# Altium project M1.5_A2L1.PrjPcb
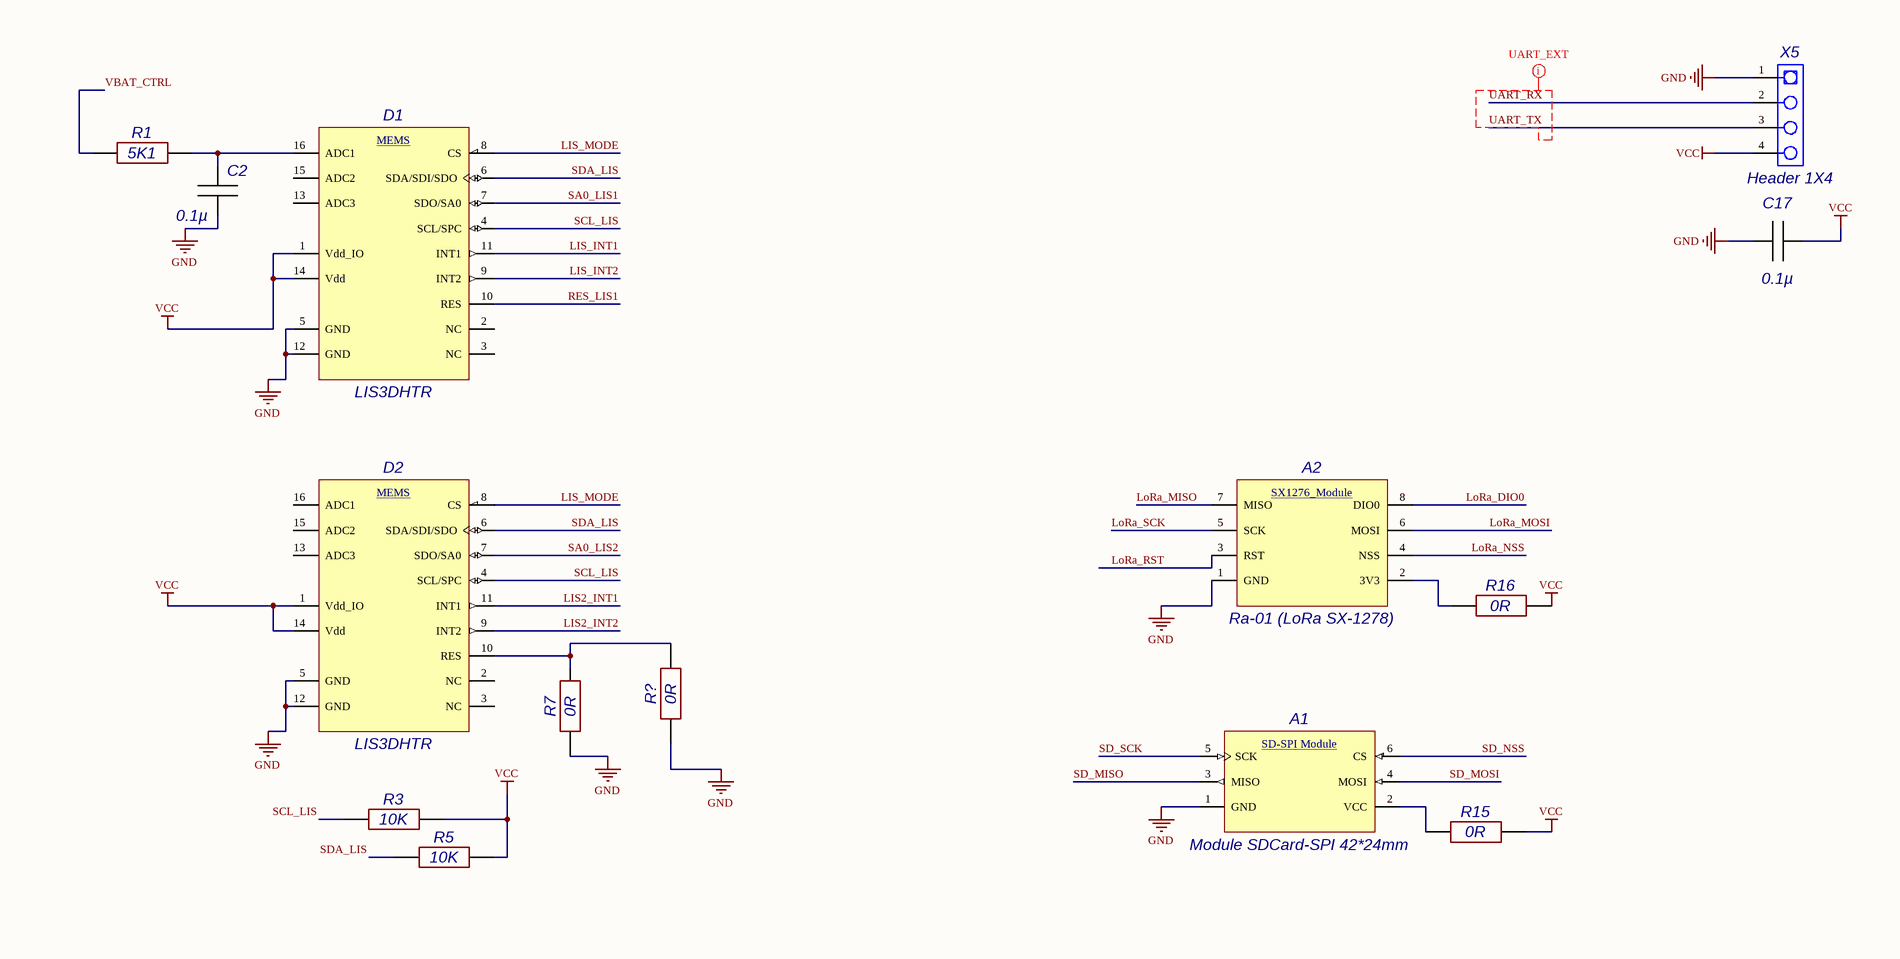
[diagram p0: M1.5_A2L1.SchDoc, top]
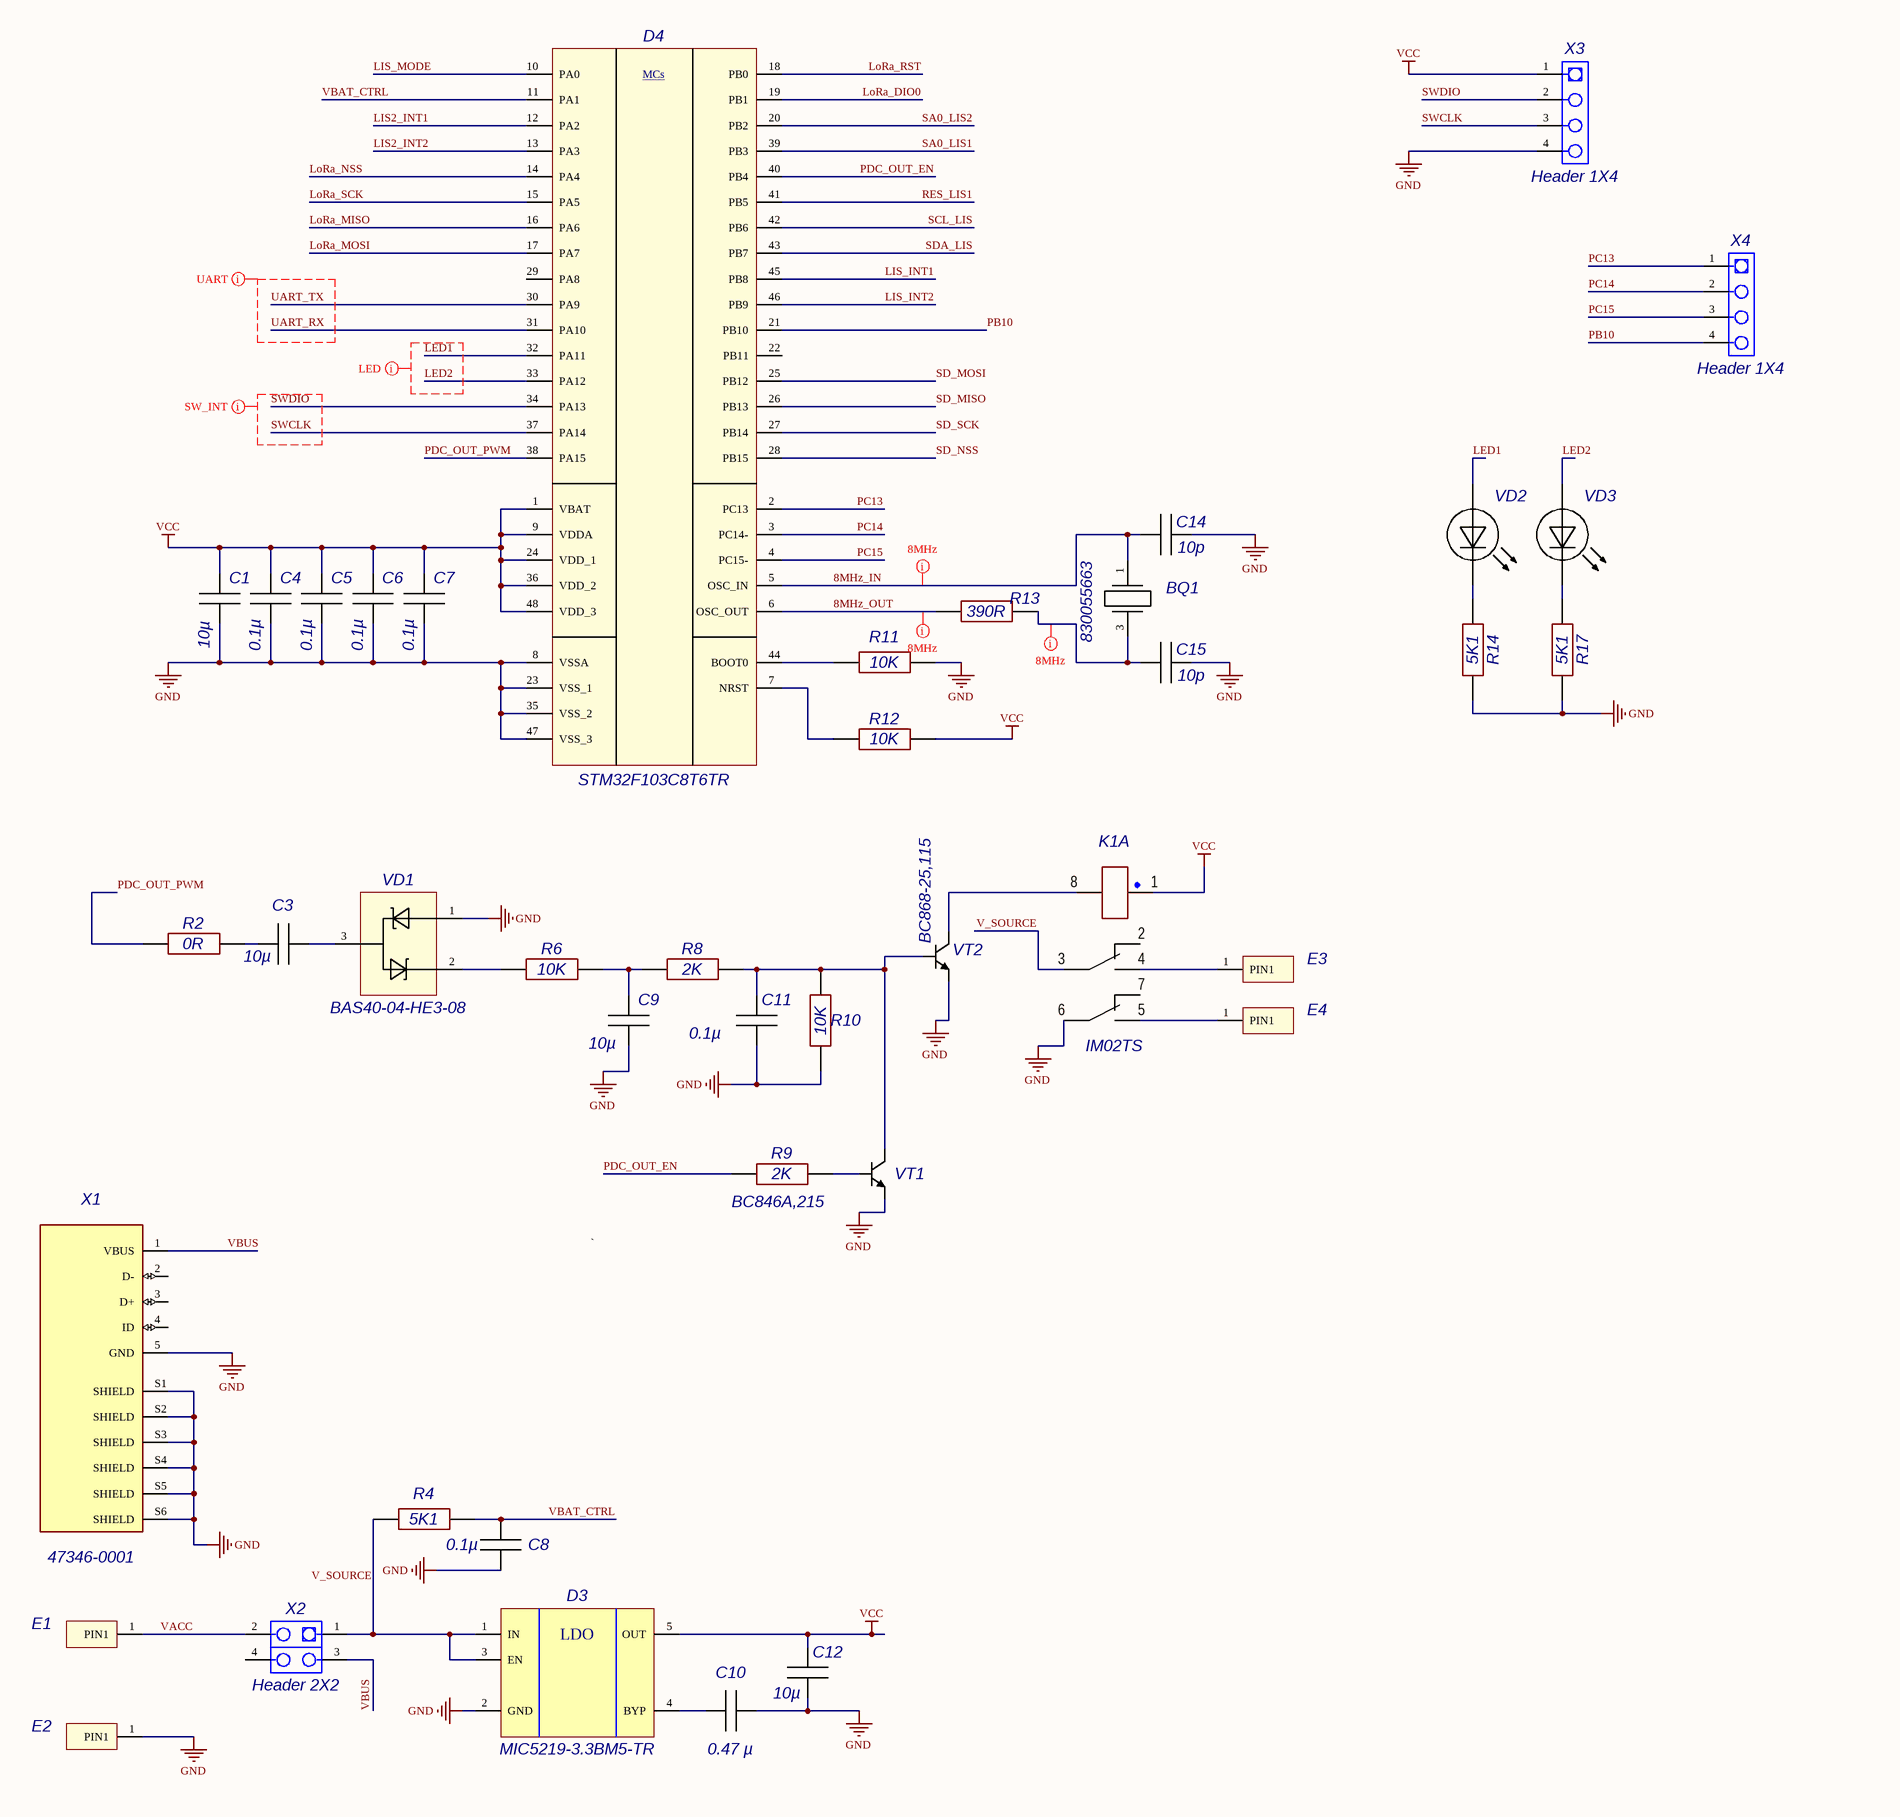
[diagram p1: M1.5_A2L1.SchDoc, bottom]
1 sheet, 55 parts. Net scope: global (net labels, ports and power ports of the same name join across sheets).
Board file: M1.7_A2L1_32mm.PcbDoc

## Sheet M1.5_A2L1.SchDoc
size A2 portrait; SheetNumber: 1; SheetTotal: 1

### Parts
A1  Module SDCard-SPI 42*24mm  [Module SD2SPI]
A2  Ra-01 (LoRa SX-1278)  [Module SX1278]
BQ1  830055663  [Quartz5032]
C1  10µ  [Cap0805]
C2  0.1µ  [Cap0603]
C3  10µ  [Cap0805]
C4  0.1µ  [Cap0603]
C5  0.1µ  [Cap0603]
C6  0.1µ  [Cap0603]
C7  0.1µ  [Cap0603]
C8  0.1µ  [Cap0603]
C9  10µ  [Cap0805]
C10  0.47 µ  [Cap0603]
C11  0.1µ  [Cap0603]
C12  10µ  [Cap0805]
C14  10p  [Cap0603]
C15  10p  [Cap0603]
C17  0.1µ  [Cap0603]
D1  LIS3DHTR  [LGA-16]
D2  LIS3DHTR  [LGA-16]
D3  MIC5219-3.3BM5-TR  [SOT23-5]
D4  STM32F103C8T6TR  [LQFP-48]
E1  Lamel_1pin  [Lamel_1pin(1.5*3)]  (value not drawn)
E2  Lamel_1pin  [Lamel_1pin(1.5*3)]  (value not drawn)
E3  Lamel_1pin  [Lamel_1pin(1.5*3)]  (value not drawn)
E4  Lamel_1pin  [Lamel_1pin(1.5*3)]  (value not drawn)
K1  IM02TS  [IM02TS]  (parts A,B,C of 3)
R1  5K1  [RES0603]
R2  0R  [RES0603]
R3  10K  [RES0603]
R4  5K1  [RES0603]
R5  10K  [RES0603]
R6  10K  [RES0603]
R7  0R  [RES0603]
R8  2K  [RES0603]
R9  2K  [RES0603]
R10  10K  [RES0603]
R11  10K  [RES0603]
R12  10K  [RES0603]
R13  390R  [RES0603]
R14  5K1  [RES0603]
R15  0R  [RES0603]
R16  0R  [RES0603]
R17  5K1  [RES0603]
R?  0R  [RES0603]
VD1  BAS40-04-HE3-08  [SOT23]
VD2  19-213/GHC-YR1S2/3T  [LED0603]  (value not drawn)
VD3  19-213/GHC-YR1S2/3T  [LED0603]  (value not drawn)
VT1  BC846A,215  [SOT23]
VT2  BC868-25,115  [SOT89]
X1  47346-0001  [MOLEX_47346-0001]
X2  Header 2X2  [PLS2-2]
X3  Header 1X4  [PLS1-4]
X4  Header 1X4  [PLS1-4]
X5  Header 1X4  [PLS1-4]

### Nets
GND: A1.1(GND) A2.1(GND) C1.2 C2.2 C4.2 C5.2 C6.2 C7.2 C8.2 C9.2 C10.2 C11.2 C12.2 C14.2 C15.2 C17.2 D1.5(GND) D1.12(GND) D2.5(GND) D2.12(GND) D3.2(GND) D4.8(VSSA) D4.23(VSS_1) D4.35(VSS_2) D4.47(VSS_3) E2.1(PIN1) K1.6 R7.1 R10.1 R11.2 R14.2 R17.2 R?.1 VD1.1 VT1.2(E) VT2.1(E) X1.5(GND) X1.S1(SHIELD) X1.S2(SHIELD) X1.S3(SHIELD) X1.S4(SHIELD) X1.S5(SHIELD) X1.S6(SHIELD) X3.4 X5.1
VCC: C1.1 C4.1 C5.1 C6.1 C7.1 C12.1 C17.1 D1.1(Vdd_IO) D1.14(Vdd) D2.1(Vdd_IO) D2.14(Vdd) D3.5(OUT) D4.1(VBAT) D4.9(VDDA) D4.24(VDD_1) D4.36(VDD_2) D4.48(VDD_3) K1.1 R3.2 R5.2 R12.2 R15.2 R16.2 X3.1 X5.4
8MHz_IN: BQ1.1(Crystal) C14.1 D4.5(OSC_IN)
8MHz_OUT: D4.6(OSC_OUT) R13.1
LED1: D4.32(PA11) VD2.1
LED2: D4.33(PA12) VD3.1
LIS2_INT1: D2.11(INT1) D4.12(PA2)
LIS2_INT2: D2.9(INT2) D4.13(PA3)
LIS_INT1: D1.11(INT1) D4.45(PB8)
LIS_INT2: D1.9(INT2) D4.46(PB9)
LIS_MODE: D1.8(CS) D2.8(CS) D4.10(PA0)
LoRa_DIO0: A2.8(DIO0) D4.19(PB1)
LoRa_MISO: A2.7(MISO) D4.16(PA6)
LoRa_MOSI: A2.6(MOSI) D4.17(PA7)
LoRa_NSS: A2.4(NSS) D4.14(PA4)
LoRa_RST: A2.3(RST) D4.18(PB0)
LoRa_SCK: A2.5(SCK) D4.15(PA5)
PB10: D4.21(PB10) X4.4
PC13: D4.2(PC13) X4.1
PC14: D4.3(PC14-) X4.2
PC15: D4.4(PC15-) X4.3
PDC_OUT_EN: D4.40(PB4) R9.1
PDC_OUT_PWM: D4.38(PA15) R2.1
RES_LIS1: D1.10(RES) D4.41(PB5)
SA0_LIS1: D1.7(SDO/SA0) D4.39(PB3)
SA0_LIS2: D2.7(SDO/SA0) D4.20(PB2)
SCL_LIS: D1.4(SCL/SPC) D2.4(SCL/SPC) D4.42(PB6) R3.1
SD_MISO: A1.3(MISO) D4.26(PB13)
SD_MOSI: A1.4(MOSI) D4.25(PB12)
SD_NSS: A1.6(CS) D4.28(PB15)
SD_SCK: A1.5(SCK) D4.27(PB14)
SDA_LIS: D1.6(SDA/SDI/SDO) D2.6(SDA/SDI/SDO) D4.43(PB7) R5.1
SWCLK: D4.37(PA14) X3.3
SWDIO: D4.34(PA13) X3.2
UART_RX: D4.31(PA10) X5.2
UART_TX: D4.30(PA9) X5.3
V_SOURCE: D3.1(IN) D3.3(EN) K1.3 R4.1 X2.1
VACC: E1.1(PIN1) X2.2
VBAT_CTRL: C8.1 D4.11(PA1) R1.1 R4.2
VBUS: X1.1(VBUS) X2.3
NetA1_2: A1.2(VCC) R15.1
NetA2_2: A2.2(3V3) R16.1
NetBQ1_3: BQ1.3(Crystal) C15.1 R13.2
NetC2_1: C2.1 D1.16(ADC1) R1.2
NetC3_1: C3.1 VD1.3
NetC3_2: C3.2 R2.2
NetC9_1: C9.1 R6.2 R8.1
NetC10_1: C10.1 D3.4(BYP)
NetC11_1: C11.1 R8.2 R10.2 VT1.3(C) VT2.3(B)
NetD2_10: D2.10(RES) R7.2 R?.2
NetD4_7: D4.7(NRST) R12.1
NetD4_44: D4.44(BOOT0) R11.1
NetE3_1: E3.1(PIN1) K1.4
NetE4_1: E4.1(PIN1) K1.5
NetK1_8: K1.8 VT2.2(C)
NetR6_1: R6.1 VD1.2
NetR9_2: R9.2 VT1.1(B)
NetR14_1: R14.1 VD2.2
NetR17_1: R17.1 VD3.2

Not connected (* = marked no-connect by the designer): D1 2(NC) 3(NC) 13(ADC3) 15(ADC2); D2 2(NC) 3(NC) 13(ADC3) 15(ADC2) 16(ADC1); D4 22(PB11) 29(PA8); K1 2 7; X1 2(D-) 3(D+) 4(ID); X2 4

### Layout directives
net class 8MHz: 8MHz_IN, 8MHz_OUT, NetBQ1_3
net class SW_INT: SWCLK, SWDIO
net class LED: LED1, LED2, UART_RX, UART_TX
net class UART_EXT: UART_RX, UART_TX

### Notes on the sheet
- `
- (in symbol LIS3DHTR) MEMS
- (in symbol MIC5219-3.3BM5-TR) LDO
- (in symbol Module SDCard-SPI) SD-SPI Module
- (in symbol Module SX1278) SX1276_Module
- (in symbol STM32F103C8T6) MCs

### Library data of the parts
A1 = Module SDCard-SPI: MicroSD Card adapter (42*24mm)/Arduino; Supply voltage: 5±0.5V; Current consumption typ(max): 80mA (200mA); Connections: 6pin IDC1-6; Support format: Micro SDCard(<=2G), Micro SDHC(<=32G); Manufacture Part Number: Module SDCard-SPI 42*24mm; ComponentLink1Description: Link; ComponentLink1URL: http://datalogger.pbworks.com/w/file/fetch/89507207/Datalogger%20-%20SD%20Memory%20Reader%20Datasheet.pdf; Dimensions: 42*24*12mm; Weight: 5g
A2 = Module SX1278: SX1278 LoRa  433 MHZ/SPI /Spring Antenna/Ra - 01; ComponentLink1Description: Link; ComponentLink1URL: http://www.ai-thinker.com/pro_view-5.html; Manufacture Part Number: Ra-01 (LoRa SX-1278)
BQ1 = 830055663: WE-XTAL QUARTZ CRYSTAL 8.0 MHZ; Manufacture: Würth Elektronik; Catagory: Crystals, Oscillators, Resonators, Crystals; Frequency: 8 MHz; Frequency Stability: ±30ppm; Frequency Tolerance: ±20ppm; Load Capacitance: 18pF; ESR (Equivalent Series Resistance): 150 Ohms; Operating Mode: Fundamental; Digi-Key Part Number: 1923-830055663TR-ND; Package/Case: 4-SMD, No Lead; Type: MHz Crystal; Price ($): $0.65; ComponentLink1Description: HelpURL; ComponentLink1URL: https://www.digikey.com/en/products/detail/w%C3%BCrth-elektronik/830055663/13900244?s=N4IgTCBcDaIBwGYAMSCsqBsGEgLoF8g; Manufacture Part Number: 830055663; Series: CFPX-104
C1 C3 C9 C12 = CC0805KKX7R6BB106: CAP CER 10UF 10V X7R 0805; Manufacture: YAGEO; Catagory: Capacitors, Ceramic Capacitors; Tolerance: ±10%; Digi-Key Part Number: 311-1879-2-ND; Manufacture Part Number: CC0805KKX7R6BB106; Package/Case: 0805 (2012 Metric); Price($/10): $1.62; ComponentLink2Description: Link; ComponentLink2URL: https://www.digikey.com/en/products/detail/yageo/CC0805KKX7R6BB106/5195285; Capacitance: 10µ; Temperature Coefficient: X7R
C2 C4-C8 C11 C17 = CC0603KRX7R9BB104: CAP CER 0.1UF 50V X7R 0603; Manufacture: YAGEO; Catagory: Capacitors, Ceramic Capacitors; Tolerance: ±10%; Digi-Key Part Number: 311-1344-2-ND; Manufacture Part Number: CC0603KRX7R9BB104; Package/Case: 0603 (1608 Metric); Price($/10): $0.54; ComponentLink2Description: Link; ComponentLink2URL: https://www.digikey.com/en/products/detail/yageo/CC0603KRX7R9BB104/2103082?s=N4IgTCBcDaIMJwAwDZEGYDSAlAGgdiwE4AhYgRkQBYQBdAXyA; Capacitance: 0.1µ; Temperature Coefficient: X7R
C10 = CC0603KRX7R6BB474: CAP CER 0.47UF 10V X7R 0603; Manufacture: YAGEO; Catagory: Capacitors, Ceramic Capacitors; Tolerance: ±10%; Digi-Key Part Number: 311-1798-2-ND; Manufacture Part Number: CC0603KRX7R6BB474; Package/Case: 0603 (1608 Metric); Price($/10): $1.22; ComponentLink2Description: Link; ComponentLink2URL: https://www.yageo.com/upload/media/product/productsearch/datasheet/mlcc/UPY-GPHC_X7R_6.3V-to-50V_20.pdf; Capacitance: 0.47 µ; Temperature Coefficient: X7R; ComponentLink3Description: Link supplier; ComponentLink3URL: https://www.digikey.com/en/products/detail/yageo/CC0603KRX7R6BB474/5195206?s=N4IgTCBcDaIMJwAwDZEGYDSAlAGgdi2QCEiAWPUkAXQF8g
C14 C15 = CQ0603JRNPO9BN100: CAP CER 10PF 50V C0G/NPO 0603; Manufacture: YAGEO; Catagory: Capacitors, Ceramic Capacitors; Temperature Coefficient: COG, NPO; Tolerance: ±5%; Digi-Key Part Number: CQ0603JRNPO9BN100-ND; Manufacture Part Number: CQ0603JRNPO9BN100; Package/Case: 0603 (1608 Metric); Price($/20k): $970,8; ComponentLink2Description: Link; ComponentLink2URL: https://www.digikey.com/en/products/detail/yageo/cq0603jrnpo9bn100/6097785; Capacitance: 10p
D1 D2 = LIS3DHTR: ACCEL 2-16G I2C/SPI 16LGA; Manufacture: STMicroelectronics; Catagory: Sensors, Transducers, Motion Sensors - Accelerometers; Digi-Key Part Number: 497-10613-2-ND - Tape & Reel; Manufacture Part Number: LIS3DHTR; Package/Case: 16-LGA (3x3); Price($): $2.11000; Value: LIS3DHTR; ComponentLink2Description: Link; ComponentLink2URL: https://www.st.com/en/mems-and-sensors/lis3dh.html; ComponentLink3Description: Link Supplier; ComponentLink3URL: https://www.digikey.com/en/products/detail/stmicroelectronics/LIS3DHTR/2334338?s=N4IgTCBcDaIDIEkDKBmAIgCQCoCUQF0BfIA
D3 = MIC5219-3.3BM5-TR: IC REG LINEAR 3.3V 500MA SOT23-5; Manufacture: Microchip Technology; Catagory: Integrated Circuits (ICs), Power Management (PMIC), Voltage Regulators - Linear; Voltage - Input (Max): 12V; Voltage Dropout (Max): 0.6V @ 500mA; Current - Quiescent (Iq): 8 µA; PSRR: 75dB (120Hz); Control Features: Enable; Digi-Key Part Number: MIC5219-3.3BM5-TR; Manufacture Part Number: MIC5219-3.3BM5-TR; Package/Case: SOT-23-5; ComponentLink2Description: Link; ComponentLink2URL: https://ww1.microchip.com/downloads/en/DeviceDoc/MIC5219-500mA-Peak-Output-LDO-Regulator-DS20006021A.pdf; Voltage - Output (Min/Fixed): 3.3V; Current - Output: 500mA; ComponentLink3Description: Link Supplier; ComponentLink3URL: https://www.digikey.com/en/products/detail/microchip-technology/MIC5219-3-3BM5-TR/771289?s=N4IgTCBcDaILIEkDCBWMBGAnAWgMwDpcAhOFEAXQF8g
D4 = STM32F103C8T6: ARM® Cortex®-M3 STM32F1 Microcontroller IC 32-Bit Single-Core 72MHz 64KB (64K x 8) FLASH 48-LQFP (7x7); Manufacture: STMicroelectronics; Catagory: Integrated Circuits (ICs), Embedded Microcontrollers; sym_version: 1; Digi-Key Part Number: 497-17666-2-ND; Manufacture Part Number: STM32F103C8T6TR; Package/Case: 48-LQFP; Price($): $7.64; Value: STM32F103C8T6TR; ComponentLink2Description: Link; ComponentLink2URL: https://www.digikey.com/en/products/detail/stmicroelectronics/STM32F103C8T6TR/2122442
K1 = IM02TS: RELAY TELECOM DPDT 2A 4.5VDC; Manufacture: TE Connectivity Potter & Brumfield Relays; Catagory: Relays, Signal Relays, Up to 2 Amps; Contact Form: DPDT (2 Form C); Switching Voltage: 250VAC, 220VDC - Max; Digi-Key Part Number: PB1093-ND; Manufacture Part Number: IM02TS; Series: IM, AXICOM; Price($): $4.59; ComponentLink2Description: Link Supplier; ComponentLink2URL: https://www.digikey.com/en/products/detail/te-connectivity-potter-brumfield-relays/IM02TS/1633979?s=N4IgTCBcDaIJIFkAMYAqBlEBdAvkA; Mounting Type: Through Hole; Coil Voltage: 4.5VDC; Contact Rating (Current): 2 A; ComponentLink3Description: Link; ComponentLink3URL: https://www.te.com/commerce/DocumentDelivery/DDEController?Action=srchrtrv&DocNm=1-1773734-7_IM_Relay_I_Type&DocType=DS&DocLang=English
R1 R4 R14 R17 = RC0603FR-075K1L: RES 5K1 OHM 1% 1/10W 0603; Manufacture: Yageo; Catagory: Resistors; Power(Watts): 0.1W, 1/10W; Digi-Key Part Number: 311-5.10KHRTR-ND; Package/Case: 0603 (1608 Metric); Tolerance: ±1%; Resistance: 5K1; Price 1k($): $3.90; ComponentLink1Description: HelpURL; ComponentLink1URL: https://www.digikey.com/en/products/detail/yageo/RC0603FR-075K1L/727268?s=N4IgTCBcDaIEoGEAMA2JBmAYnAtEg7AKwDSAjADIgC6AvkA; Manufacture Part Number: RC0603FR-075K1L
R2 R7 R15 R16 R? = RC0603FR-070RL: RES 0 OHM JUMPER 1/10W 0603; Manufacture: Yageo; Catagory: Resistors; Power(Watts): 0.1W, 1/10W; Tolerance: ±1%; Digi-Key Part Number: 311-0.0HRTR-ND; Package/Case: 0603 (1608 Metric); Resistance: 0R; Price 1k($): $3.29; ComponentLink1Description: Link Supplier; ComponentLink1URL: https://www.digikey.com/en/products/detail/yageo/RC0603FR-075K1L/727268?s=N4IgTCBcDaIEoGEAMA2JBmAYnAtEg7AKwDSAjADIgC6AvkA; Manufacture Part Number: RC0603FR-070RL; ComponentLink2Description: Link; ComponentLink2URL: https://www.yageo.com/upload/media/product/productsearch/datasheet/rchip/PYu-RC_Group_51_RoHS_L_12.pdf
R3 R5 R6 R10-R12 = RC0603FR-0710KL: RES 10K OHM 1% 1/10W 0603; Manufacture: Yageo; Catagory: Resistors; Power(Watts): 0.1W, 1/10W; Digi-Key Part Number: 311-10.0KHRTR-ND; Package/Case: 0603 (1608 Metric); Tolerance: ±1%; Resistance: 10K; Price 1k($): $3.90; ComponentLink1Description: HelpURL; ComponentLink1URL: https://www.digikey.com/en/products/detail/yageo/RC0603FR-0710KL/726880?s=N4IgTCBcDaIEoGEAMA2JBmAYnAtEg7AIxIDSAMiALoC%2BQA; Manufacture Part Number: RC0603FR-0710KL
R8 R9 = RC0603FR-072KL: RES 2K OHM 1% 1/10W 0603; Manufacture: Yageo; Catagory: Resistors; Power(Watts): 0.1W, 1/10W; Digi-Key Part Number: 311-2.00KHRTR-ND; Package/Case: 0603 (1608 Metric); Tolerance: ±1%; Resistance: 2K; Price 1k($): $3.90; ComponentLink1Description: Link Supplier; ComponentLink1URL: https://www.digikey.com/en/products/detail/yageo/RC0603FR-072KL/727009?s=N4IgTCBcDaIEoGEAMA2JBmAYnAtEg7GANIAyIAugL5A; Manufacture Part Number: RC0603FR-072KL; ComponentLink2Description: Link; ComponentLink2URL: https://www.yageo.com/upload/media/product/productsearch/datasheet/rchip/PYu-RC_Group_51_RoHS_L_12.pdf
R13 = RC0603FR-07390RL: RES 390 OHM 1% 1/10W 0603; Manufacture: Yageo; Catagory: Resistors; Power(Watts): 0.1W, 1/10W; Digi-Key Part Number: 311-390HRTR-ND; Package/Case: 0603 (1608 Metric); Tolerance: ±1%; Resistance: 390R; Price 1k($): $3.90; ComponentLink1Description: HelpURL; ComponentLink1URL: https://www.digikey.com/en/products/detail/yageo/RC0603FR-07390RL/727198; Manufacture Part Number: RC0603FR-07390RL
VD1 = BAS40-04: DIODE ARRAY SCHOTTKY 40V SOT23; Manufacture: Vishay General Semiconductor - Diodes Division; Catagory: Discrete Semiconductor Products, Diodes - Rectifiers - Arrays; Value: SOT-23-3; Diode Configuration: 1 Pair Series Connection; Current - Average Rectified (Io) (per Diode): 200mA; Voltage - Forward (Vf) (Max) @ If: 1 V @ 40 mA; Reverse Recovery Time (trr): 5 ns; Current - Reverse Leakage @ Vr: 100 nA @ 30 V; Digi-Key Part Number: 112-BAS40-04-HE3-08TR-ND; Manufacture Part Number: BAS40-04-HE3-08; Package/Case: SOT-23-3; Price 10pcs($): $3.03 per 10pcs; ComponentLink2Description: Link Supplier; ComponentLink2URL: https://www.digikey.com/en/products/detail/vishay-general-semiconductor-diodes-division/BAS40-04-HE3-08/4830200; Diode Type: Schottky; Voltage - DC Reverse (Vr) (Max): 40 V; ComponentLink3Description: Link; ComponentLink3URL: https://www.vishay.com/docs/85701/bas40v.pdf
VD2 VD3 = 19-213/GHC-YR1S2/3T: LED GREEN CLEAR 0603 SMD; Manufacture: Everlight Electronics Co Ltd; Catagory: Optoelectronics, LED Indication - Discrete; Millicandela Rating: 199mcd; Voltage - Forward (Vf) (Typ): 3.3V; Current - Test: 20mA; Viewing Angle: 120°; Wavelength - Dominant: 528nm; Wavelength - Peak: 518nm; Lens Color: Colorless; Lens Style: Rectangle with Flat Top; Lens Size: 1.20mm x 0.80mm; Digi-Key Part Number: 19-213/GHC-YR1S2/3T-ND; Package/Case: 0603 (1608 Metric); Color: Green; Price 1k($): $7.02; ComponentLink1Description: HelpURL; ComponentLink1URL: https://www.digikey.com/en/products/detail/everlight-electronics-co-ltd/19-213-GHC-YR1S2-3T/2691511?s=N4IgTCBcDaIDIFMAmACAjATgLRjQZgHoBxACQGEsBNAJTQGUwC8AVEAXQF8g; Manufacture Part Number: 19-213/GHC-YR1S2/3T; Size / Dimension: *; Lens Transparency: Clear; Height(Max): 0.70mm
VT1 = BC846: TRANS NPN 65V 0.1A SOT-23-3; Manufacture: Nexperia USA Inc.; Catagory: Discrete Semiconductor Products, Transistors - Bipolar (BJT) - Single; Power(Watts): 250 mW; Current - Collector (Ic) (Max): 100 mA; Vce Saturation (Max) @ Ib, Ic: 400mV @ 5mA, 100mA; Current - Collector Cutoff (Max): 15nA (ICBO); DC Current Gain (hFE) (Min) @ Ic, Vce: 110 @ 2mA, 5V; Frequency - Transition: 100MHz; Digi-Key Part Number: 1727-4239-2-ND; Package/Case: SOT-323; Price ($): $0.14; ComponentLink1Description: Link Supplier; ComponentLink1URL: https://www.digikey.com/en/products/detail/nexperia-usa-inc/BC846A-215/1232259; Manufacture Part Number: BC846A,215; Voltage - Collector Emitter Breakdown (Max): 65 V; Operating Temperature: 150°C (TJ); ComponentLink2Description: Link; ComponentLink2URL: https://assets.nexperia.com/documents/data-sheet/BC846XW_SER.pdf
VT2 = BC868-25: TRANS NPN 20V 2A SOT89; Manufacture: Nexperia USA Inc.; Catagory: Discrete Semiconductor Products, Transistors - Bipolar (BJT) - Single; Power(Watts): 500 mW; Vce Saturation (Max) @ Ib, Ic: 600mV @ 200mA, 2A; Current - Collector Cutoff (Max): 100nA (ICBO); DC Current Gain (hFE) (Min) @ Ic, Vce: 160 @ 500mA, 1V; Frequency - Transition: 170MHz; Digi-Key Part Number: 1727-1568-2-ND; Package/Case: TO-243AA; Transistor Type: NPN; Current - Collector (Ic) (Max): 2 A; Price ($): $0.54; ComponentLink1Description: Link; ComponentLink1URL: https://assets.nexperia.com/documents/data-sheet/BCP68_BC868_BC68PA.pdf; Manufacture Part Number: BC868-25,115; Voltage - Collector Emitter Breakdown (Max): 20 V; Operating Temperature: 150°C (TJ); Value: BC868-25,115; ComponentLink2Description: Link Supplier; ComponentLink2URL: https://www.digikey.com/en/products/detail/nexperia-usa-inc/BC868-25-115/1232370
X1 = 47346-0001: CONN RCPT USB2.0 MICRO B SMD R/A; Manufacture: Molex; Connector Type: USB - micro B; Current Rating (Amps): 1A, 1.8A; Voltage - Rated: 30VAC; Mating Cycles: 10000; Shielding: Shielded; Material Flammability Rating: UL94 V-0; SnapEDA_Link: https://www.snapeda.com/parts/47346-0001/Molex/view-part/53503/?ref=snap; Manufacture Part Number: 47346-0001; Digi-Key Part Number: WM17141TR-ND; Series: 47346; Parameter 3: *; Specifications: USB 2.0; Mounting Type: Surface Mount, Right Angle; Mounting Feature: Horizontal; Contact Finish: Gold; Shell/Shielding Material: Steel, Stainless
X2 = KLS1-207-2-2S: 2X2 Pin Header Double Row Through Hole Pitch 2.54(PLS-2); Manufacture: Assmann WSW components, Inc; Manufacture Part Number: Header KLS1-207-2-2S; Catagory: Connector Headers and PCB Receptacles; Checked PCB: *; Checked SCH: *; Parameter 1: *; ComponentLink1Description: HelpURL; ComponentLink1URL: https://www.arrow.com/en/products/aw140-eg-g02a/assmann-wsw-components-inc
X3-X5 = KLS1-207-1-4S: 1X4 Pin Header Single Row Through Hole Pitch 2.54; Manufacture: Assmann WSW components, Inc; Catagory: Connector Headers and PCB Receptacles; Checked PCB: *; Checked SCH: *; Parameter 1: *; Manufacture Part Number: *; ComponentLink1Description: HelpURL; ComponentLink1URL: https://www.arrow.com/en/products/aw140-eg-g02a/assmann-wsw-components-inc